# EAGLE design test (EAGLE 9.6.2)
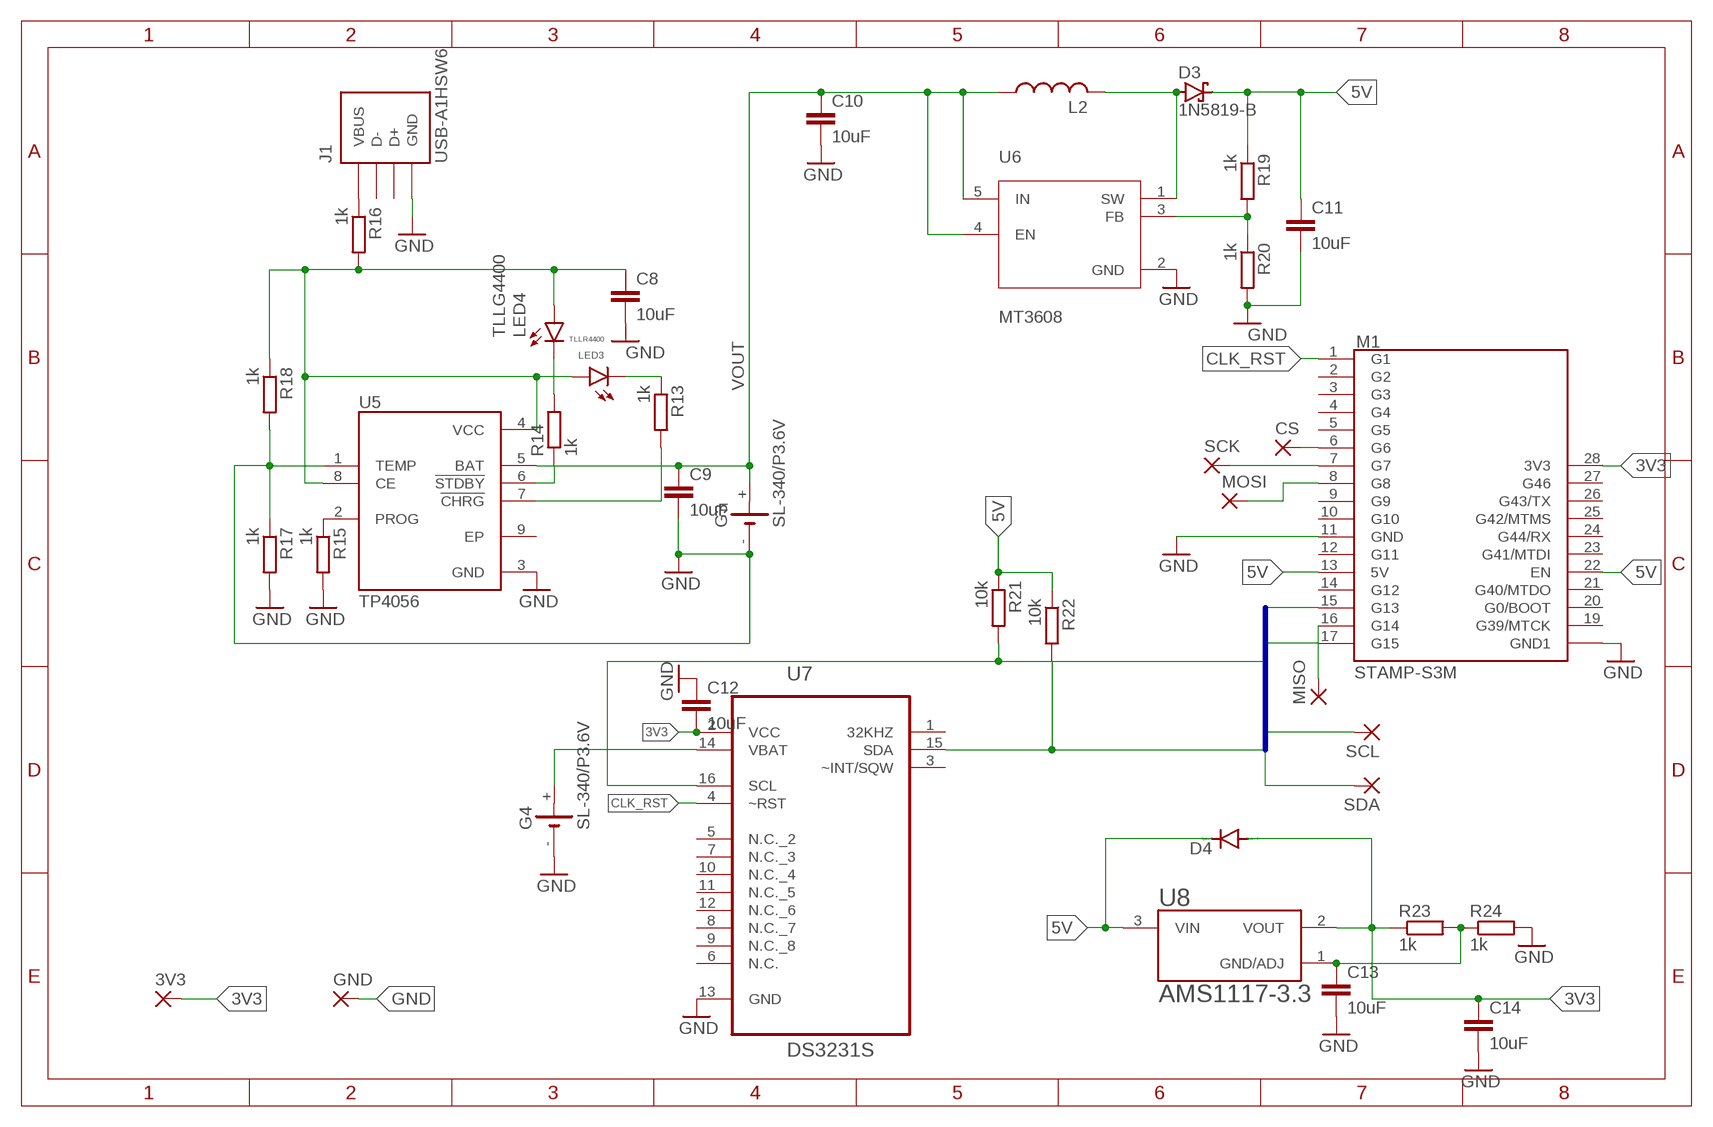
[diagram p0: schematic, sheet 1]

## Parts
3V3  1,6/0,8  [1,6/0,8]
C8  10uF  C2,5-3  [C2.5-3]
C9  10uF  C2,5-3  [C2.5-3]
C10  10uF  C2,5-3  [C2.5-3]
C11  10uF  C2,5-3  [C2.5-3]
C12  10uF  C2,5-3  [C2.5-3]
C13  10uF  C2,5-3  [C2.5-3]
C14  10uF  C2,5-3  [C2.5-3]
CS  1,6/0,8  [1,6/0,8]
D3  1N5819-B  [DO41-7.6]
D4  DIODE-D-2.5  [D-2.5]
G3  SL-340/P3.6V  [SL-340/P3.6V]
G4  SL-340/P3.6V  [SL-340/P3.6V]
GND  1,6/0,8  [1,6/0,8]
J1  USB-A1HSW6  [OST_USB-A1HSW6]
L2  L-US0204/7  [0204/7]
LED3  TLLR4400  [LED3MM]
LED4  TLLG4400  [LED3MM]
MISO  1,6/0,8  [1,6/0,8]
MOSI  1,6/0,8  [1,6/0,8]
R13  1k  R-EU_0204/2V  [0204V]
R14  1k  R-EU_0204/2V  [0204V]
R15  1k  R-EU_0204/2V  [0204V]
R16  1k  R-EU_0204/2V  [0204V]
R17  1k  R-EU_0204/2V  [0204V]
R18  1k  R-EU_0204/2V  [0204V]
R19  1k  R-EU_0204/2V  [0204V]
R20  1k  R-EU_0204/2V  [0204V]
R21  10k  R-EU_0204/2V  [0204V]
R22  10k  R-EU_0204/2V  [0204V]
R23  1k  R-EU_0204/2V  [0204V]
R24  1k  R-EU_0204/2V  [0204V]
SCK  1,6/0,8  [1,6/0,8]
SCL  1,6/0,8  [1,6/0,8]
SDA  1,6/0,8  [1,6/0,8]
U5  TP4056  [SOP127P600X175-9N]
U6  MT3608  [SOT95P280X145-6N]
U7  DS3231S  [SOIC127P1032X265-16N]
U8  AMS1117-3.3  [SOT229P700X180-4N]
U$1  STAMP-S3M-PIN  [STAMPS3_PIN_FTP]

## Nets
3V3: 3V3.1(P) C12.2 C14.1 D4.A R23.1 U7.2(VCC) U8.2(VOUT) U$1.28(3V3)
5V: C11.1 D3.C D4.C R19.1 R21.1 R22.1 U8.3(VIN) U$1.13(5V) U$1.22(EN)
CHRG: R13.2 U5.7(!CHRG)
CLK_RST: U7.4(~RST) U$1.1(G1)
CS: CS.1(P) U$1.6(G6)
FB: R19.2 R20.1 U6.3(FB)
GND: C8.2 C9.2 C10.2 C11.2 C12.1 C13.2 C14.2 G3.- G4.- GND.1(P) J1.4(GND) R15.2 R17.1 R17.2 R18.2 R20.2 R24.2 U5.1(TEMP) U5.3(GND) U6.2(GND) U7.13(GND) U$1.11(GND) U$1.18(GND1)
MISO: MISO.1(P) U$1.16(G14)
MOSI: MOSI.1(P) U$1.8(G8)
N$1: R15.1 U5.2(PROG)
N$13: LED4.K(C) R14.2
N$14: LED3.K(C) R13.1
N$20: C13.1 R23.2 R24.1 U8.1(GND/ADJ)
SCK: SCK.1(P) U$1.7(G7)
SCL: R21.2 SCL.1(P) U7.16(SCL) U$1.17(G15)
SDA: R22.2 SDA.1(P) U7.15(SDA) U$1.15(G13)
STDBY: R14.1 U5.6(!STDBY)
SW: D3.A L2.2 U6.1(SW)
USB1: C8.1 J1.1(VBUS) LED3.A LED4.A R16.1 R16.2 R18.1 U5.4(VCC) U5.8(CE)
VBAT: G4.+ U7.14(VBAT)
VOUT: C9.1 C10.1 G3.+ L2.1 U5.5(BAT) U6.4(EN) U6.5(IN)
Unconnected: J1.2(D-) J1.3(D+) U5.9(EP) U7.1(32KHZ) U7.3(~INT/SQW) U7.5(N.C._2) U7.6(N.C.) U7.7(N.C._3) U7.8(N.C._7) U7.9(N.C._8) U7.10(N.C._4) U7.11(N.C._5) U7.12(N.C._6) U$1.2(G2) U$1.3(G3) U$1.4(G4) U$1.5(G5) U$1.9(G9) U$1.10(G10) U$1.12(G11) U$1.14(G12) U$1.19(G39/MTCK) U$1.20(G0/BOOT) U$1.21(G40/MTDO) U$1.23(G41/MTDI) U$1.24(G44/RX) U$1.25(G42/MTMS) U$1.26(G43/TX) U$1.27(G46)

## Buses
SCL,SDA

## Library data of the parts
3V3 CS GND MISO MOSI SCK SCL SDA = wirepad:1,6/0,8: THROUGH-HOLE PAD
C8-C14 = capacitor-wima:C: CAPACITOR naming: grid - package width
D3 = diode:1N581*: 1.0A SCHOTTKY BARRIER RECTIFIER Source: http://www.diodes.com/datasheets/ds23001.pdf
D4 = diode:DIODE-: DIODE
G3 G4 = battery:SL-340/P3.6V: LI BATTERY Sonnenschein
J1 = USB-A1HSW6:USB-A1HSW6: Check availability <https://pricing.snapeda.com/parts/USB-A1HSW6/On%20Shore/view-part?ref=eda>; AVAILABILITY: In Stock; CHECK_PRICES: https://www.snapeda.com/parts/USB-A1HSW6/ON/view-part/?ref=eda; DESCRIPTION: USB-A (USB TYPE-A) - Receptacle Connector 4 Position Through Hole, Right Angle; MF: On Shore; MP: USB-A1HSW6; PACKAGE: None; PRICE: None; SNAPEDA_LINK: https://www.snapeda.com/parts/USB-A1HSW6/ON/view-part/?ref=snap
L2 = rcl:L-US: INDUCTOR, American symbol; SPICEPREFIX: L
LED3 = led:TLLR4400: Low Current (2mA) LED 3 mm Tinted Diffused Package color RED Source: Data sheet <http://www.farnell.com/datasheets/391100.pdf>; MF: VISHAY SEMICONDUCTOR; OC_FARNELL: 1612437
LED4 = led:TLLG4400: Low Current (2mA) LED 3 mm Tinted Diffused Package color GREEN Source: Data sheet <http://www.farnell.com/datasheets/391098.pdf>; MF: VISHAY SEMICONDUCTOR; OC_FARNELL: 1612435
R13-R24 = rcl:R-EU_: RESISTOR, European symbol; SPICEPREFIX: R
U5 = TP4056:TP4056: Check availability <https://pricing.snapeda.com/parts/TP4056/NanJing%20Top%20Power%20ASIC%20Corp./view-part?ref=eda>; AVAILABILITY: Not in stock; CHECK_PRICES: https://www.snapeda.com/parts/TP4056/NanJing+Top+Power+ASIC+Corp./view-part/?ref=eda; DESCRIPTION: Complete single cell Li-Ion battery with a constant current / constant voltage linear charger; MF: NanJing Top Power ASIC Corp.; MP: TP4056; PACKAGE: Package; PRICE: None; SNAPEDA_LINK: https://www.snapeda.com/parts/TP4056/NanJing+Top+Power+ASIC+Corp./view-part/?ref=snap
U6 = MT3608:MT3608: Check availability <https://pricing.snapeda.com/parts/MT3608/Aerosemi%20Technology%20Co.%2C%20Ltd/view-part?ref=eda>; AVAILABILITY: Not in stock; CHECK_PRICES: https://www.snapeda.com/parts/MT3608/Aerosemi+Technology+Co.%252C+Ltd/view-part/?ref=eda; DESCRIPTION: High Efficiency 1.2MHz 2A Step Up Converter; MF: Aerosemi Technology Co., Ltd; MP: MT3608; PACKAGE: Package; PRICE: None; SNAPEDA_LINK: https://www.snapeda.com/parts/MT3608/Aerosemi+Technology+Co.%252C+Ltd/view-part/?ref=snap
U7 = DS3231S:DS3231S: Check availability <https://pricing.snapeda.com/parts/DS3231S%23/Analog%20Devices/view-part?ref=eda>; AVAILABILITY: In Stock; CHECK_PRICES: https://www.snapeda.com/parts/DS3231S%23/Analog+Devices/view-part/?ref=eda; DESCRIPTION: Extremely Accurate I²C-Integrated RTC/TCXO/Crystal; MF: Analog Devices; MP: DS3231S#; PACKAGE: SOIC-16 Maxim; PRICE: None; SNAPEDA_LINK: https://www.snapeda.com/parts/DS3231S%23/Analog+Devices/view-part/?ref=snap
U8 = AMS1117-3.3:AMS1117-3.3: Check availability <https://pricing.snapeda.com/parts/AMS1117-3.3/Advanced%20Monolithic%20Systems/view-part?ref=eda>; AVAILABILITY: Not in stock; CHECK_PRICES: https://www.snapeda.com/parts/AMS1117-3.3/Advanced+Monolithic+Systems/view-part/?ref=eda; DESCRIPTION: Sot223/Pkg 1-Amp 3.3-Volt Low Drop Out Voltage Regulatator; MF: Advanced Monolithic Systems; MP: AMS1117-3.3; PACKAGE: SOT-223 Seeed Technology; PRICE: None; SNAPEDA_LINK: https://www.snapeda.com/parts/AMS1117-3.3/Advanced+Monolithic+Systems/view-part/?ref=snap
U$1 = StampS3:STAMP-S3M-PIN

## Board
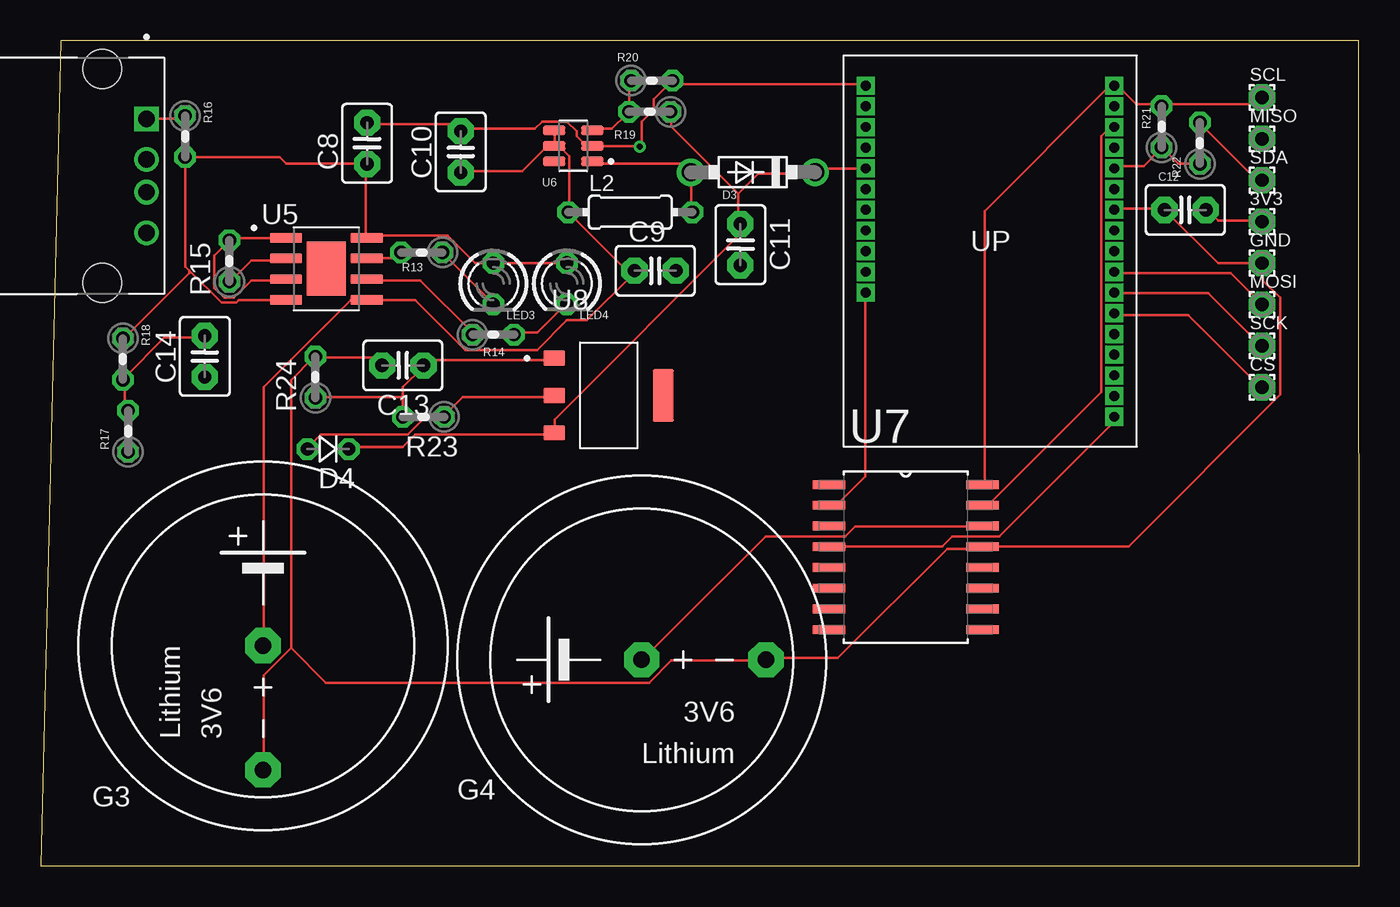
[diagram p1: board, top side]
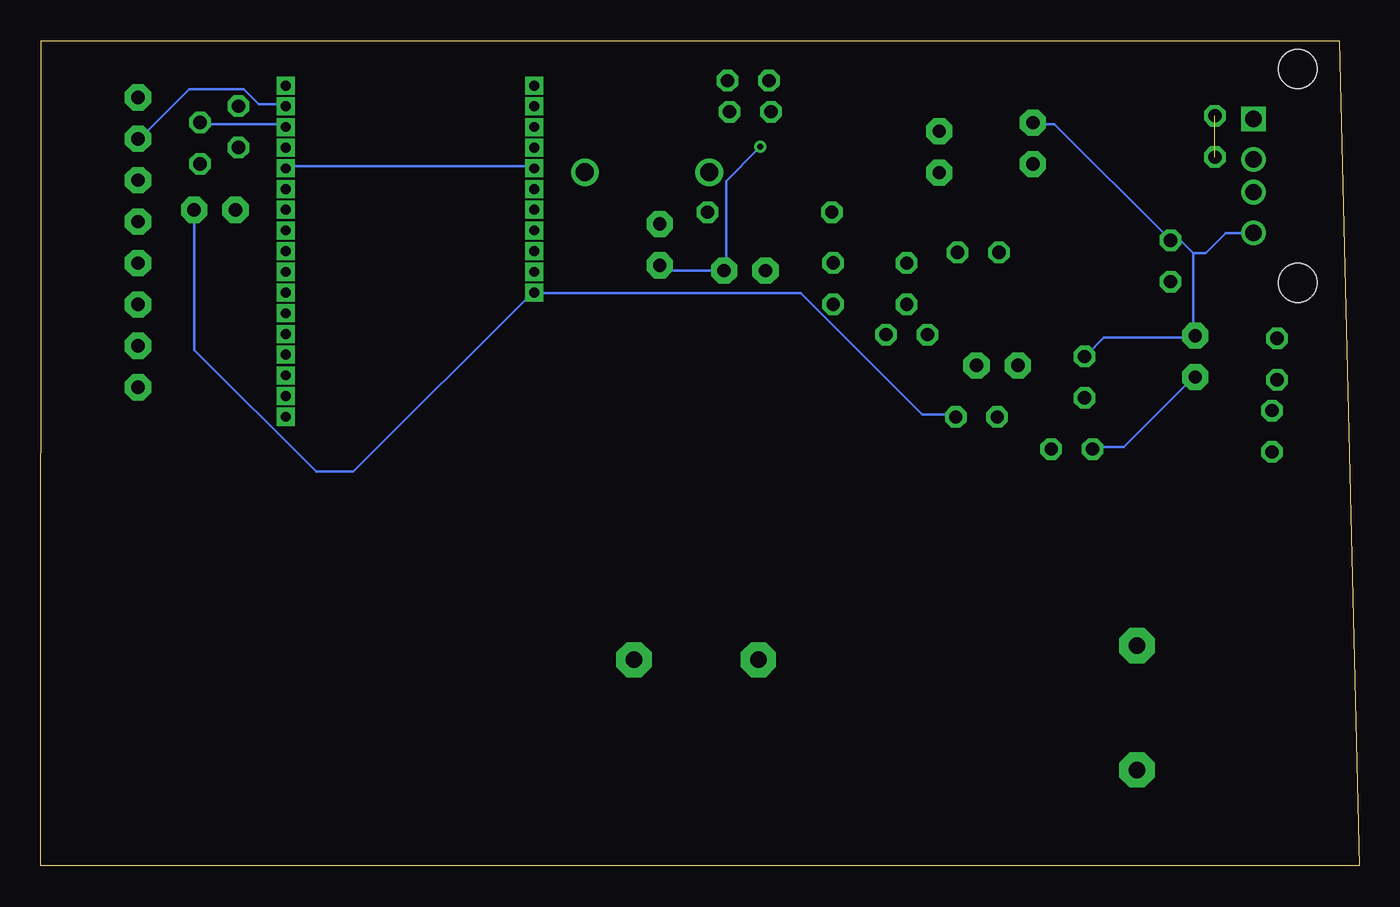
[diagram p2: board, bottom side, seen from below]

Size 80.85 x 50.62 mm. Coordinates in mm from the lower left corner, seen from the top.
Outline: 0,0 80.85,0 80.81,50.62 1.23,50.62 0,0
Copper layers (1*16): Top 0.035mm / dielectric 1.5mm / Bottom 0.035mm
Design rules "default": minimum track width 6mil, minimum drill 0.35mm, track to track 6mil, track to pad 6mil, pad to pad 6mil, via to via 6mil, smd to smd 6mil, copper to edge 40mil, drill to drill 6mil, minimum pad ring 10mil, minimum via ring 8mil, stop-mask expansion 4mil, vias tented up to drill 0mil, thermal gap 10mil

### Footprints (pad centres in the part's own frame; a part is rotated, then mirrored left to right if it is on the bottom)
1,6/0,8 = drill 0.813 pad 1.6 octagon: 1 0,0
C2.5-3 = drill 0.813 pad 1.6 octagon: 1 -1.27,0; 2 1.27,0
DO41-7.6 = drill 1.1 pad 1.7: A 3.81,0; C -3.81,0
D-2.5 = drill 0.813 octagon: A 1.27,0; C -1.27,0
SL-340/P3.6V = drill 1.016 pad 2.159 octagon: + 0,0; - -7.62,0
OST_USB-A1HSW6 = drill 1 square: 1 -3.5,2.71 | drill 1: 2 -1,2.71; 3 1,2.71; 4 3.5,2.71 | hole 2.38: -6.57,0; 6.57,0
0204/7 = drill 0.813 octagon: 1 -3.81,0; 2 3.81,0
LED3MM = drill 0.813 octagon: A -1.27,0; K 1.27,0
0204V = drill 0.813 octagon: 1 -1.27,0; 2 1.27,0
SOP127P600X175-9N = smd 1.97 x 0.6: 1 -2.475,1.905; 2 -2.475,0.635; 3 -2.475,-0.635; 4 -2.475,-1.905; 5 2.475,-1.905; 6 2.475,-0.635; 7 2.475,0.635; 8 2.475,1.905 | smd 2.413 x 3.302: 9 0,0
SOT95P280X145-6N = smd 1.37 x 0.59: 1 -1.17,0.95; 2 -1.17,0; 3 -1.17,-0.95; 4 1.17,-0.95; 5 1.17,0; 6 1.17,0.95
SOIC127P1032X265-16N = smd 1.981 x 0.533: 1 -4.699,4.445; 2 -4.699,3.175; 3 -4.699,1.905; 4 -4.699,0.635; 5 -4.699,-0.635; 6 -4.699,-1.905; 7 -4.699,-3.175; 8 -4.699,-4.445; 9 4.699,-4.445; 10 4.699,-3.175; 11 4.699,-1.905; 12 4.699,-0.635; 13 4.699,0.635; 14 4.699,1.905; 15 4.699,3.175; 16 4.699,4.445
SOT229P700X180-4N = smd 1.31 x 0.93: 1 -3.345,2.29; 2 -3.345,0; 3 -3.345,-2.29 | smd 1.31 x 3.24: 4 3.345,0
STAMPS3_PIN_FTP = drill 0.6 square: 1 -3.81,7.62; 2 -3.81,6.35; 3 -3.81,5.08; 4 -3.81,3.81; 5 -3.81,2.54; 6 -3.81,1.27; 7 -3.81,0; 8 -3.81,-1.27; 9 -3.81,-2.54; 10 -3.81,-3.81; 11 -3.81,-5.08; 12 -3.81,-6.35; 13 -3.81,-7.62; 14 -3.81,-8.89; 15 -3.81,-10.16; 16 -3.81,-11.43; 17 -3.81,-12.7; 18 11.43,-12.7; 19 11.43,-11.43; 20 11.43,-10.16; 21 11.43,-8.89; 22 11.43,-7.62; 23 11.43,-6.35; 24 11.43,-5.08; 25 11.43,-3.81; 26 11.43,-2.54; 27 11.43,-1.27; 28 11.43,0

### Placement (x,y rotation side)
3V3  74.89,39.52 0 top
C8  20.01,44.33 90 top
C9  37.68,36.51 0 top
C10  25.75,43.8 90 top
C11  42.9,38.11 270 top
C12  70.18,40.24 0 top
C13  22.2,30.7 180 top
C14  10.06,31.25 90 top
CS  74.89,29.36 0 top
D3  43.67,42.55 180 top
D4  17.62,25.57 180 top
G3  13.63,13.5 90 top
G4  36.85,12.64 180 top
GND  74.89,36.98 0 top
J1  3.77,42.33 270 top
L2  36.15,40.1 0 top
LED3  27.75,35.71 270 top
LED4  32.26,35.72 270 top
MISO  74.89,44.6 0 top
MOSI  74.89,34.44 0 top
R13  23.36,37.63 180 top
R14  27.75,32.59 0 top
R15  11.57,37.11 90 top
R16  8.85,44.75 270 top
R17  5.35,26.66 90 top
R18  5.04,31.09 270 top
R19  37.34,46.26 180 top
R20  37.47,48.17 0 top
R21  68.73,45.34 90 top
R22  71.08,44.34 90 top
R23  23.47,27.54 180 top
R24  16.84,29.98 90 top
SCK  74.89,31.9 0 top
SCL  74.89,47.14 0 top
SDA  74.89,42.06 0 top
U5  17.51,36.63 0 top
U6  32.65,44.17 180 top
U7  53.04,18.94 0 top
U8  34.83,28.86 0 top
U$1  62.02,35.17 180 top

### Tracks (layer width: path | path; a pad name or v marks a point on that pad's centre or on a via)
3V3
  Top 0.152: 50.71,35.15 U$1.28 50.56,35.15 50.56,23.87 48.88,22.2 48.42,22.2 U7.2 | U8.2 31.35,28.75 25.87,28.75 24.8,27.68 R23.1 24.65,27.53 23.58,27.53 22.52,26.46 17.18,26.46 16.42,25.7 D4.A | 3V3.1 74.79,39.57 72.2,39.57 71.59,40.18 C12.2
  Bottom 0.152: 71.59,40.18 C12.2 71.44,40.18 71.44,31.65 63.97,24.18 61.68,24.18 50.71,35.15 U$1.28 50.56,35.15 34.25,35.15 26.78,27.68 24.8,27.68 R23.1 | D4.A 16.27,25.7 14.44,25.7 10.17,29.97 C14.1
5V
  Top 0.152: D4.C 19.01,25.7 22.21,25.7 22.97,26.46 31.35,26.46 U8.3 31.51,26.62 31.51,27.38 42.78,38.66 42.78,39.27 C11.1 42.78,39.42 42.78,41.25 | U$1.13 65.95,42.92 67.63,42.92 68.69,43.99 R21.1 68.84,43.99 69.76,43.08 70.98,43.08 R22.1 | U$1.22 50.56,42.77 47.66,42.77 47.51,42.62 D3.C 47.36,42.47 44,42.47 42.78,41.25 | 42.78,41.25 38.67,45.36 38.67,46.12 R19.1
  Bottom 0.152: U$1.13 65.8,42.92 50.71,42.92 U$1.22
CHRG
  Top 0.152: U5.7 20.08,37.28 21.75,37.28 22.06,37.59 R13.2
CLK_RST
  Top 0.152: U7.4 48.42,19.61 55.28,19.61 55.89,20.22 58.79,20.22 65.8,27.23 65.8,27.53 U$1.1
CS
  Top 0.152: 66.25,33.78 65.95,33.78 U$1.6 66.25,33.78 | 66.25,33.78 70.37,33.78 74.79,29.36 CS.1
FB
  Top 0.152: U6.3 33.95,45.21 35.01,45.21 35.93,46.12 R19.2 36.08,46.28 36.08,48.11 R20.1
GND  (via drill 0.35)
  Top 0.152: 33.55,44.17 U6.2 | 14.88,38.38 U5.1 14.9,38.5 11.7,38.5 R15.2 11.54,38.35 10.63,37.44 10.63,35.46 11.24,34.85 11.85,34.85 12.91,35.91 14.9,35.91 U5.3 | U$1.11 65.95,40.33 68.84,40.33 C12.1 69,40.18 72.2,36.98 GND.1 74.94,36.98 74.94,35.91 76.01,34.85 76.01,28.9 66.71,19.61 57.87,19.61 U7.13 57.72,19.45 55.59,19.45 48.88,12.75 44.61,12.75 G4.- 44.46,12.6 38.67,12.6 37.3,11.22 17.49,11.22 15.35,13.36 | C8.2 20.08,45.51 25.41,45.51 25.72,45.21 C10.2 25.87,45.21 30.29,45.21 30.74,45.67 32.27,45.67 32.88,45.06 32.88,44.75 33.49,44.14 U6.2 | U6.2 33.95,44.14 36.69,44.14 v36.73,44.12 36.84,44.14 36.84,45.67 37.6,46.43 37.6,47.04 38.67,48.11 R20.2 38.82,48.11 38.97,47.95 50.56,47.95 U$1.18 | 10.02,32.56 C14.2 10.02,32.41 7.58,32.41 5.14,29.97 R18.2 5.14,29.82 5.14,28.14 5.29,27.99 R17.2 5.45,27.84 5.45,25.4 R17.1 | C13.2 20.84,30.73 20.38,31.19 16.88,31.19 R24.2 16.72,31.19 15.35,29.82 15.35,13.36 | 15.35,13.36 13.68,11.68 13.68,5.89 G3.-
  Bottom 0.152: 69,40.18 C12.1 | C11.2 42.78,36.83 42.48,36.52 38.97,36.52 C9.2 38.82,36.52 38.82,42.01 36.84,43.99 v36.73,44.12 | 11.08,38.5 11.54,38.5 R15.2 | 10.17,37.59 10.17,32.56 C14.2 10.17,32.41 15.66,32.41 16.72,31.34 R24.2 | 11.08,38.5 10.17,37.59 | 11.08,38.5 R15.2 | C8.2 19.92,45.51 18.7,45.51 11.7,38.5 R15.2 | 10.17,37.59 9.41,37.59 8.19,38.81 6.51,38.81 J1.4
MISO
  Bottom 0.152: U$1.16 65.95,46.73 67.47,46.73 68.39,47.65 71.74,47.65 74.79,44.6 MISO.1
MOSI
  Top 0.152: 65.95,36.52 U$1.8 65.95,36.37 72.96,36.37 MOSI.1
N$1
  Top 0.152: 14.84,37.46 U5.2 14.9,37.13 12.91,37.13 11.7,35.91 R15.1
N$13
  Top 0.152: R14.2 29.07,32.71 30.44,32.71 32.12,34.39 LED4.K
N$14
  Top 0.152: R13.1 24.65,37.59 27.7,34.54 LED3.K
N$20
  Top 0.152: U8.1 31.35,31.04 23.89,31.04 23.58,30.73 C13.1 23.43,30.58 22.21,29.36 22.21,28.75 | 22.21,28.75 22.21,27.68 R23.2 | 22.21,28.75 16.88,28.75 R24.1
SCK
  Top 0.152: U$1.7 65.95,35.15 71.59,35.15 74.79,31.95 SCK.1
SCL
  Top 0.152: U7.16 57.87,23.42 57.87,40.18 65.49,47.8 65.8,47.8 U$1.17 65.95,47.95 67.17,46.73 68.69,46.73 R21.2 68.84,46.73 74.48,46.73 SCL.1
SDA
  Top 0.152: U7.15 57.87,22.2 58.18,22.2 65.03,29.06 65.03,44.75 65.49,45.21 65.8,45.21 U$1.15 | SDA.1 74.79,42.16 74.48,42.16 71.13,45.51 R22.2
  Bottom 0.152: 70.83,45.51 66.1,45.51 65.95,45.36 U$1.15 | 70.83,45.51 70.98,45.51 R22.2 70.83,45.51
STDBY
  Top 0.152: U5.6 20.08,35.91 23.28,35.91 26.48,32.71 R14.1
SW
  Top 0.152: 33.92,43.12 U6.1 33.95,43.08 39.28,43.08 39.74,42.62 D3.A 39.89,42.47 39.89,40.18 L2.2
USB1  (1 unrouted)
  Top 0.152: LED4.A 32.12,36.98 LED3.A 26.63,36.98 24.95,38.66 20.08,38.66 U5.8 19.92,38.66 19.92,42.92 C8.1 19.92,43.08 15.05,43.08 14.64,43.48 R16.2 8.85,36.78 9.1,36.52 | 9.1,36.52 11.08,34.54 12,34.54 12.15,34.69 14.9,34.69 U5.4 | 9.1,36.52 9.1,36.37 5.14,32.41 R18.1 | 6.51,45.82 J1.1 8.66,45.83 R16.1
VBAT
  Top 0.152: 57.96,20.62 U7.14 57.72,20.83 49.95,20.83 49.34,20.22 44.46,20.22 36.99,12.75 G4.+
VOUT
  Top 0.152: U5.5 20.09,34.62 | U6.5 31.51,44.3 31.51,45.06 U6.4 | U6.5 31.51,44.14 31.81,44.14 32.42,43.53 32.42,40.18 L2.1 32.42,40.03 36.23,36.22 | C10.1 25.87,42.62 29.53,42.62 31.05,44.14 31.35,44.14 U6.5 | 36.23,36.22 36.38,36.37 C9.1 36.23,36.22 | 36.23,36.22 33.49,33.47 32.27,33.47 30.44,31.65 26.02,31.65 22.97,34.69 20.08,34.69 U5.5 | G3.+ 13.68,13.51 13.68,29.36 19.01,34.69 19.92,34.69 U5.5